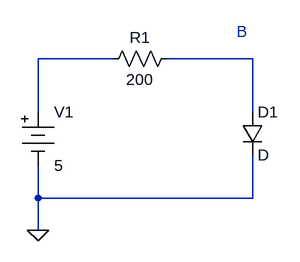
[diagram p0: schematic Yoneda-p78.asc]
Yoneda-p78.asc, the LTspice schematic file:
Version 4
SHEET 1 880 680
WIRE 192 0 80 0
WIRE 400 0 272 0
WIRE 80 80 80 0
WIRE 400 80 400 0
WIRE 80 208 80 160
WIRE 400 208 400 144
WIRE 400 208 80 208
WIRE 80 256 80 208
FLAG 80 256 0
SYMBOL res 288 -16 R90
WINDOW 0 0 56 VBottom 2
WINDOW 3 32 56 VTop 2
SYMATTR InstName R1
SYMATTR Value 200
SYMBOL Misc\\battery 80 64 R0
SYMATTR InstName V1
SYMATTR Value 5
SYMBOL diode 384 80 R0
SYMATTR InstName D1
TEXT 376 -40 Left 2 ;B

The netlist it stands for:
* Yoneda-p78.asc
R1 N002 N001 200
V1 N001 0 5
D1 N002 0 D
.model D D
.lib standard.dio
* B
.backanno
.end